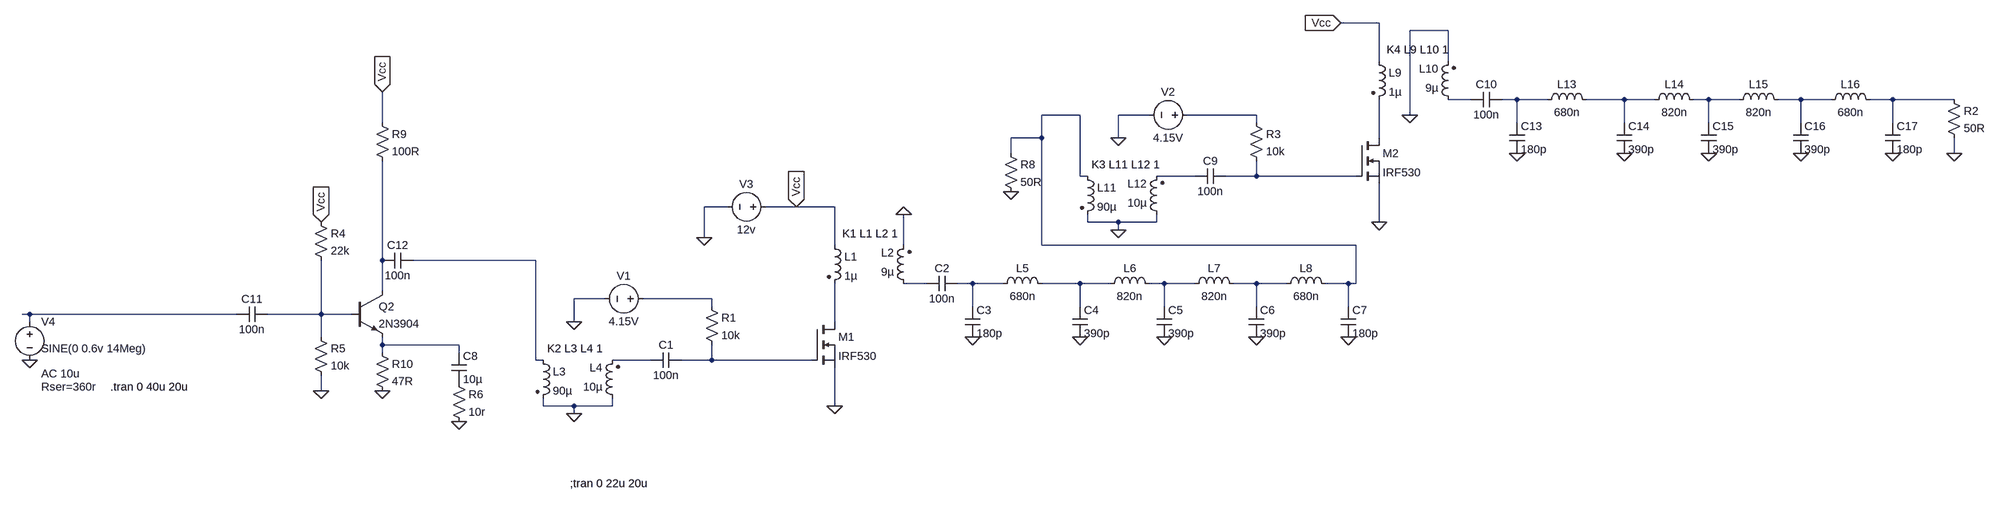
[diagram p0: schematic RF_OUT_PREAMP+AMP.asc]
RF_OUT_PREAMP+AMP.asc, the LTspice schematic file:
Version 4
SHEET 1 2900 680
WIRE 1120 -736 1040 -736
WIRE 1264 -720 1184 -720
WIRE 1120 -656 1120 -736
WIRE 1264 -656 1264 -720
WIRE 1312 -576 1264 -576
WIRE 1408 -576 1376 -576
WIRE 1472 -576 1408 -576
WIRE 1632 -576 1552 -576
WIRE 1696 -576 1632 -576
WIRE 1808 -576 1776 -576
WIRE 1872 -576 1808 -576
WIRE 2000 -576 1952 -576
WIRE 2064 -576 2000 -576
WIRE 2192 -576 2144 -576
WIRE 2320 -576 2192 -576
WIRE 496 -544 416 -544
WIRE 640 -544 576 -544
WIRE 864 -544 720 -544
WIRE 1184 -544 1184 -720
WIRE -1968 -528 -1968 -592
WIRE 864 -528 864 -544
WIRE 1408 -528 1408 -576
WIRE 1632 -528 1632 -576
WIRE 1808 -528 1808 -576
WIRE 2000 -528 2000 -576
WIRE 2192 -528 2192 -576
WIRE 416 -496 416 -544
WIRE 416 -496 352 -496
WIRE 576 -496 576 -544
WIRE 1120 -496 1120 -576
WIRE 352 -464 352 -496
WIRE 2320 -464 2320 -496
WIRE 496 -416 496 -544
WIRE 512 -416 496 -416
WIRE 736 -416 656 -416
WIRE 864 -416 864 -448
WIRE 864 -416 800 -416
WIRE 1072 -416 864 -416
WIRE -240 -352 -288 -352
WIRE -96 -352 -160 -352
WIRE -16 -352 -96 -352
WIRE 512 -320 512 -336
WIRE 576 -320 512 -320
WIRE 656 -320 656 -336
WIRE 656 -320 576 -320
WIRE 1120 -320 1120 -400
WIRE 576 -304 576 -320
WIRE -288 -288 -288 -352
WIRE -16 -272 -16 -352
WIRE 128 -272 128 -336
WIRE 416 -272 416 -496
WIRE 1072 -272 416 -272
WIRE -1968 -240 -1968 -448
WIRE -640 -240 -1904 -240
WIRE 176 -192 128 -192
WIRE 272 -192 240 -192
WIRE 336 -192 272 -192
WIRE 496 -192 416 -192
WIRE 560 -192 496 -192
WIRE 672 -192 640 -192
WIRE 736 -192 672 -192
WIRE 864 -192 816 -192
WIRE 928 -192 864 -192
WIRE 1056 -192 1008 -192
WIRE 1072 -192 1072 -272
WIRE 1072 -192 1056 -192
WIRE -1968 -176 -1968 -240
WIRE -496 -160 -560 -160
WIRE -272 -160 -416 -160
WIRE -272 -144 -272 -160
WIRE 272 -144 272 -192
WIRE 496 -144 496 -192
WIRE 672 -144 672 -192
WIRE 864 -144 864 -192
WIRE 1056 -144 1056 -192
WIRE -2704 -128 -2720 -128
WIRE -2272 -128 -2704 -128
WIRE -2096 -128 -2096 -240
WIRE -2096 -128 -2208 -128
WIRE -2032 -128 -2096 -128
WIRE -2704 -112 -2704 -128
WIRE -560 -112 -560 -160
WIRE -16 -112 -16 -192
WIRE -2096 -80 -2096 -128
WIRE -1968 -64 -1968 -80
WIRE -1808 -64 -1968 -64
WIRE -1968 -48 -1968 -64
WIRE -1808 -48 -1808 -64
WIRE -640 -32 -640 -240
WIRE -624 -32 -640 -32
WIRE -400 -32 -480 -32
WIRE -272 -32 -272 -64
WIRE -272 -32 -336 -32
WIRE -64 -32 -272 -32
WIRE -2096 32 -2096 0
WIRE -624 64 -624 48
WIRE -560 64 -624 64
WIRE -480 64 -480 48
WIRE -480 64 -560 64
WIRE -16 64 -16 -16
WIRE -560 80 -560 64
FLAG -16 64 0
FLAG -560 -112 0
FLAG -288 -288 0
FLAG -560 80 0
FLAG 272 -80 0
FLAG 496 -80 0
FLAG 672 -80 0
FLAG 864 -80 0
FLAG 1056 -80 0
FLAG -96 -352 Vcc
IOPIN -96 -352 In
FLAG -1968 -592 Vcc
IOPIN -1968 -592 In
FLAG -1968 32 0
FLAG -2704 -32 0
FLAG -2096 32 0
FLAG -2096 -320 Vcc
IOPIN -2096 -320 In
FLAG -1808 96 0
FLAG 1120 -320 0
FLAG 576 -496 0
FLAG 576 -304 0
FLAG 1408 -464 0
FLAG 1632 -464 0
FLAG 1808 -464 0
FLAG 2000 -464 0
FLAG 2192 -464 0
FLAG 1040 -736 Vcc
IOPIN 1040 -736 In
FLAG 2320 -464 0
FLAG 128 -336 0
FLAG 1184 -544 0
FLAG 352 -384 0
SYMBOL nmos -64 -112 R0
SYMATTR InstName M1
SYMATTR Value IRF530
SYMBOL cap -336 -48 R90
WINDOW 0 0 32 VBottom 2
WINDOW 3 32 32 VTop 2
SYMATTR InstName C1
SYMATTR Value 100n
SYMBOL res -288 -160 R0
SYMATTR InstName R1
SYMATTR Value 10k
SYMBOL voltage -400 -160 R90
WINDOW 0 -32 56 VBottom 2
WINDOW 3 32 56 VTop 2
WINDOW 123 0 0 Left 0
WINDOW 39 0 0 Left 0
SYMATTR InstName V1
SYMATTR Value 4.15V
SYMBOL ind2 -32 -288 R0
SYMATTR InstName L1
SYMATTR Value 1µ
SYMATTR Type ind
SYMBOL voltage -144 -352 R90
WINDOW 0 -32 56 VBottom 2
WINDOW 3 32 56 VTop 2
WINDOW 123 0 0 Left 0
WINDOW 39 0 0 Left 0
SYMATTR InstName V3
SYMATTR Value 12v
SYMBOL ind2 144 -176 R180
WINDOW 0 36 80 Left 2
WINDOW 3 36 40 Left 2
SYMATTR InstName L2
SYMATTR Value 9µ
SYMATTR Type ind
SYMBOL cap 240 -208 R90
WINDOW 0 0 32 VBottom 2
WINDOW 3 32 32 VTop 2
SYMATTR InstName C2
SYMATTR Value 100n
SYMBOL ind2 -640 -48 R0
SYMATTR InstName L3
SYMATTR Value 90µ
SYMATTR Type ind
SYMATTR SpiceLine Rser=0.1r
SYMBOL ind2 -464 64 R180
WINDOW 0 36 80 Left 2
WINDOW 3 36 40 Left 2
SYMATTR InstName L4
SYMATTR Value 10µ
SYMATTR Type ind
SYMBOL ind 320 -176 R270
WINDOW 0 32 56 VTop 2
WINDOW 3 5 56 VBottom 2
SYMATTR InstName L5
SYMATTR Value 680n
SYMBOL cap 256 -144 R0
SYMATTR InstName C3
SYMATTR Value 180p
SYMBOL ind 544 -176 R270
WINDOW 0 32 56 VTop 2
WINDOW 3 5 56 VBottom 2
SYMATTR InstName L6
SYMATTR Value 820n
SYMBOL cap 480 -144 R0
SYMATTR InstName C4
SYMATTR Value 390p
SYMBOL ind 720 -176 R270
WINDOW 0 32 56 VTop 2
WINDOW 3 5 56 VBottom 2
SYMATTR InstName L7
SYMATTR Value 820n
SYMBOL cap 656 -144 R0
SYMATTR InstName C5
SYMATTR Value 390p
SYMBOL ind 912 -176 R270
WINDOW 0 32 56 VTop 2
WINDOW 3 5 56 VBottom 2
SYMATTR InstName L8
SYMATTR Value 680n
SYMBOL cap 848 -144 R0
SYMATTR InstName C6
SYMATTR Value 390p
SYMBOL cap 1040 -144 R0
SYMATTR InstName C7
SYMATTR Value 180p
SYMBOL cap -2208 -144 R90
WINDOW 0 0 32 VBottom 2
WINDOW 3 32 32 VTop 2
SYMATTR InstName C11
SYMATTR Value 100n
SYMBOL npn -2032 -176 R0
SYMATTR InstName Q2
SYMATTR Value 2N3904
SYMBOL res -1984 -544 R0
SYMATTR InstName R9
SYMATTR Value 100R
SYMBOL cap -1904 -256 R90
WINDOW 0 0 32 VBottom 2
WINDOW 3 32 32 VTop 2
SYMATTR InstName C12
SYMATTR Value 100n
SYMBOL res -1984 -64 R0
SYMATTR InstName R10
SYMATTR Value 47R
SYMBOL voltage -2704 -128 R0
WINDOW 123 24 124 Left 2
WINDOW 39 24 152 Left 2
WINDOW 3 24 72 Left 2
SYMATTR Value2 AC 10u
SYMATTR SpiceLine Rser=360r
SYMATTR Value SINE(0 0.6v 14Meg)
SYMATTR InstName V4
SYMBOL res -2112 -336 R0
SYMATTR InstName R4
SYMATTR Value 22k
SYMBOL res -2112 -96 R0
SYMATTR InstName R5
SYMATTR Value 10k
SYMBOL cap -1824 -48 R0
SYMATTR InstName C8
SYMATTR Value 10µ
SYMBOL res -1824 0 R0
SYMATTR InstName R6
SYMATTR Value 10r
SYMBOL nmos 1072 -496 R0
SYMATTR InstName M2
SYMATTR Value IRF530
SYMBOL cap 800 -432 R90
WINDOW 0 0 32 VBottom 2
WINDOW 3 32 32 VTop 2
SYMATTR InstName C9
SYMATTR Value 100n
SYMBOL res 848 -544 R0
SYMATTR InstName R3
SYMATTR Value 10k
SYMBOL voltage 736 -544 R90
WINDOW 0 -32 56 VBottom 2
WINDOW 3 32 56 VTop 2
WINDOW 123 0 0 Left 0
WINDOW 39 0 0 Left 0
SYMATTR InstName V2
SYMATTR Value 4.15V
SYMBOL ind2 1104 -672 R0
SYMATTR InstName L9
SYMATTR Value 1µ
SYMATTR Type ind
SYMBOL ind2 1280 -560 R180
WINDOW 0 36 80 Left 2
WINDOW 3 36 40 Left 2
SYMATTR InstName L10
SYMATTR Value 9µ
SYMATTR Type ind
SYMBOL cap 1376 -592 R90
WINDOW 0 0 32 VBottom 2
WINDOW 3 32 32 VTop 2
SYMATTR InstName C10
SYMATTR Value 100n
SYMBOL ind2 496 -432 R0
SYMATTR InstName L11
SYMATTR Value 90µ
SYMATTR Type ind
SYMATTR SpiceLine Rser=0.1r
SYMBOL ind2 672 -320 R180
WINDOW 0 36 80 Left 2
WINDOW 3 36 40 Left 2
SYMATTR InstName L12
SYMATTR Value 10µ
SYMATTR Type ind
SYMBOL ind 1456 -560 R270
WINDOW 0 32 56 VTop 2
WINDOW 3 5 56 VBottom 2
SYMATTR InstName L13
SYMATTR Value 680n
SYMBOL cap 1392 -528 R0
SYMATTR InstName C13
SYMATTR Value 180p
SYMBOL ind 1680 -560 R270
WINDOW 0 32 56 VTop 2
WINDOW 3 5 56 VBottom 2
SYMATTR InstName L14
SYMATTR Value 820n
SYMBOL cap 1616 -528 R0
SYMATTR InstName C14
SYMATTR Value 390p
SYMBOL ind 1856 -560 R270
WINDOW 0 32 56 VTop 2
WINDOW 3 5 56 VBottom 2
SYMATTR InstName L15
SYMATTR Value 820n
SYMBOL cap 1792 -528 R0
SYMATTR InstName C15
SYMATTR Value 390p
SYMBOL ind 2048 -560 R270
WINDOW 0 32 56 VTop 2
WINDOW 3 5 56 VBottom 2
SYMATTR InstName L16
SYMATTR Value 680n
SYMBOL cap 1984 -528 R0
SYMATTR InstName C16
SYMATTR Value 390p
SYMBOL cap 2176 -528 R0
SYMATTR InstName C17
SYMATTR Value 180p
SYMBOL res 2304 -592 R0
SYMATTR InstName R2
SYMATTR Value 50R
SYMBOL res 336 -480 R0
SYMATTR InstName R8
SYMATTR Value 50R
TEXT 0 -296 Left 2 !K1 L1 L2 1
TEXT -616 -56 Left 2 !K2 L3 L4 1
TEXT -568 232 Left 2 !;tran 0 22u 20u
TEXT -2536 24 Left 2 !.tran 0 40u 20u
TEXT 1136 -680 Left 2 !K4 L9 L10 1
TEXT 520 -440 Left 2 !K3 L11 L12 1

The netlist it stands for:
* RF_OUT_PREAMP+AMP.asc
M1 N022 N025 0 0 IRF530
C1 N025 N024 100n
R1 N019 N025 10k
V1 N019 0 4.15V
L1 Vcc N022 1µ
V3 Vcc 0 12v
L2 N014 0 9µ
C2 N015 N014 100n
L3 N013 0 90µ Rser=0.1r
L4 0 N024 10µ
L5 N015 N016 680n
C3 N015 0 180p
L6 N016 N017 820n
C4 N016 0 390p
L7 N017 N018 820n
C5 N017 0 390p
L8 N018 N007 680n
C6 N018 0 390p
C7 N007 0 180p
C11 N021 N020 100n
Q2 N012 N021 N023 0 2N3904
R9 Vcc N012 100R
C12 N013 N012 100n
R10 N023 0 47R
V4 N020 0 SINE(0 0.6v 14Meg) AC 10u Rser=360r
R4 Vcc N021 22k
R5 N021 0 10k
C8 N023 P001 10µ
R6 P001 0 10r
M2 N009 N011 0 0 IRF530
C9 N011 N010 100n
R3 N008 N011 10k
V2 N008 0 4.15V
L9 Vcc N009 1µ
L10 N001 0 9µ
C10 N002 N001 100n
L11 N007 0 90µ Rser=0.1r
L12 0 N010 10µ
L13 N002 N003 680n
C13 N002 0 180p
L14 N003 N004 820n
C14 N003 0 390p
L15 N004 N005 820n
C15 N004 0 390p
L16 N005 N006 680n
C16 N005 0 390p
C17 N006 0 180p
R2 N006 0 50R
R8 N007 0 50R
.model NPN NPN
.model PNP PNP
.lib standard.bjt
.model NMOS NMOS
.model PMOS PMOS
.lib standard.mos
K1 L1 L2 1
K2 L3 L4 1
;tran 0 22u 20u
.tran 0 40u 20u
K4 L9 L10 1
K3 L11 L12 1
.backanno
.end